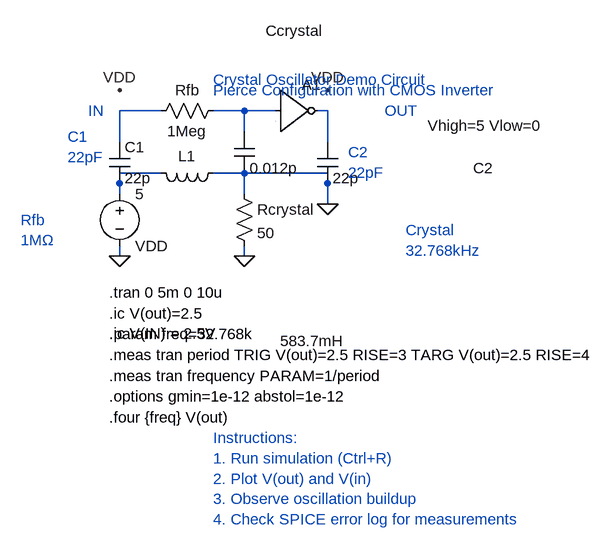
[diagram p0: schematic osc.asc]
osc.asc, the LTspice schematic file:
Version 4
SHEET 1 880 688
WIRE 160 80 96 80
WIRE 288 80 240 80
WIRE 336 80 288 80
WIRE 416 80 400 80
WIRE 288 112 288 80
WIRE 96 128 96 80
WIRE 416 128 416 80
WIRE 160 176 96 176
WIRE 288 176 240 176
WIRE 416 176 288 176
WIRE 96 192 96 176
WIRE 416 192 416 176
WIRE 96 208 96 192
WIRE 288 208 288 176
WIRE 416 224 416 192
WIRE 96 304 96 288
WIRE 288 304 288 288
FLAG 96 304 0
FLAG 288 304 0
FLAG 416 224 0
FLAG 96 48 VDD
FLAG 416 48 VDD
SYMBOL res 256 64 R90
WINDOW 0 0 56 VBottom 2
WINDOW 3 32 56 VTop 2
SYMATTR InstName Rfb
SYMATTR Value 1Meg
SYMBOL cap 80 128 R0
SYMATTR InstName C1
SYMATTR Value 22p
SYMBOL cap 400 128 R0
WINDOW 0 240 40 Left 2
SYMATTR InstName C2
SYMATTR Value 22p
SYMBOL ind 256 160 R90
WINDOW 0 5 56 VBottom 2
WINDOW 3 259 -136 VTop 2
SYMATTR InstName L1
SYMATTR Value 583.7mH
SYMBOL cap 272 112 R0
WINDOW 0 49 -155 Left 2
SYMATTR InstName Ccrystal
SYMATTR Value 0.012p
SYMBOL res 272 192 R0
SYMATTR InstName Rcrystal
SYMATTR Value 50
SYMBOL voltage 96 192 R0
WINDOW 0 24 96 Left 2
WINDOW 3 24 16 Left 2
WINDOW 123 0 0 Left 0
WINDOW 39 0 0 Left 0
SYMATTR InstName VDD
SYMATTR Value 5
SYMBOL inv 336 16 R0
WINDOW 3 234 87 Left 2
SYMATTR InstName A1
SYMATTR Value Vhigh=5 Vlow=0
TEXT 80 360 Left 2 !.tran 0 5m 0 10u
TEXT 80 392 Left 2 !.ic V(out)=2.5\n.ic V(IN) = 2.5V
TEXT 80 424 Left 2 !.param freq=32.768k
TEXT 80 456 Left 2 !.meas tran period TRIG V(out)=2.5 RISE=3 TARG V(out)=2.5 RISE=4
TEXT 80 488 Left 2 !.meas tran frequency PARAM=1/period
TEXT 80 520 Left 2 !.options gmin=1e-12 abstol=1e-12
TEXT 80 552 Left 2 !.four {freq} V(out)
TEXT 240 32 Left 2 ;Crystal Oscillator Demo Circuit
TEXT 240 48 Left 2 ;Pierce Configuration with CMOS Inverter
TEXT 504 80 Left 2 ;OUT
TEXT 48 80 Left 2 ;IN
TEXT -56 248 Left 2 ;Rfb\n1MΩ
TEXT 16 120 Left 2 ;C1\n22pF
TEXT 448 144 Left 2 ;C2\n22pF
TEXT 536 264 Left 2 ;Crystal\n32.768kHz
TEXT 240 584 Left 2 ;Instructions:\n1. Run simulation (Ctrl+R)\n2. Plot V(out) and V(in)\n3. Observe oscillation buildup\n4. Check SPICE error log for measurements

The netlist it stands for:
* osc.asc
Rfb N002 N001 1Meg
C1 N001 N004 22p
C2 N003 0 22p
L1 0 N004 583.7mH
Ccrystal N002 0 0.012p
Rcrystal 0 0 50
VDD N004 0 5
A1 N002 0 0 0 0 N003 0 0 BUF Vhigh=5 Vlow=0
.tran 0 5m 0 10u
.ic V(out)=2.5
.ic V(IN) = 2.5V
.param freq=32.768k
.meas tran period TRIG V(out)=2.5 RISE=3 TARG V(out)=2.5 RISE=4
.meas tran frequency PARAM=1/period
.options gmin=1e-12 abstol=1e-12
.four {freq} V(out)
* Crystal Oscillator Demo Circuit
* Pierce Configuration with CMOS Inverter
* OUT
* IN
* Rfb
* 1MΩ
* C1
* 22pF
* C2
* 22pF
* Crystal
* 32.768kHz
* Instructions:
* 1. Run simulation (Ctrl+R)
* 2. Plot V(out) and V(in)
* 3. Observe oscillation buildup
* 4. Check SPICE error log for measurements
.backanno
.end